# EAGLE design USB_RS232_Adaper_V2 (EAGLE 9.6.2)
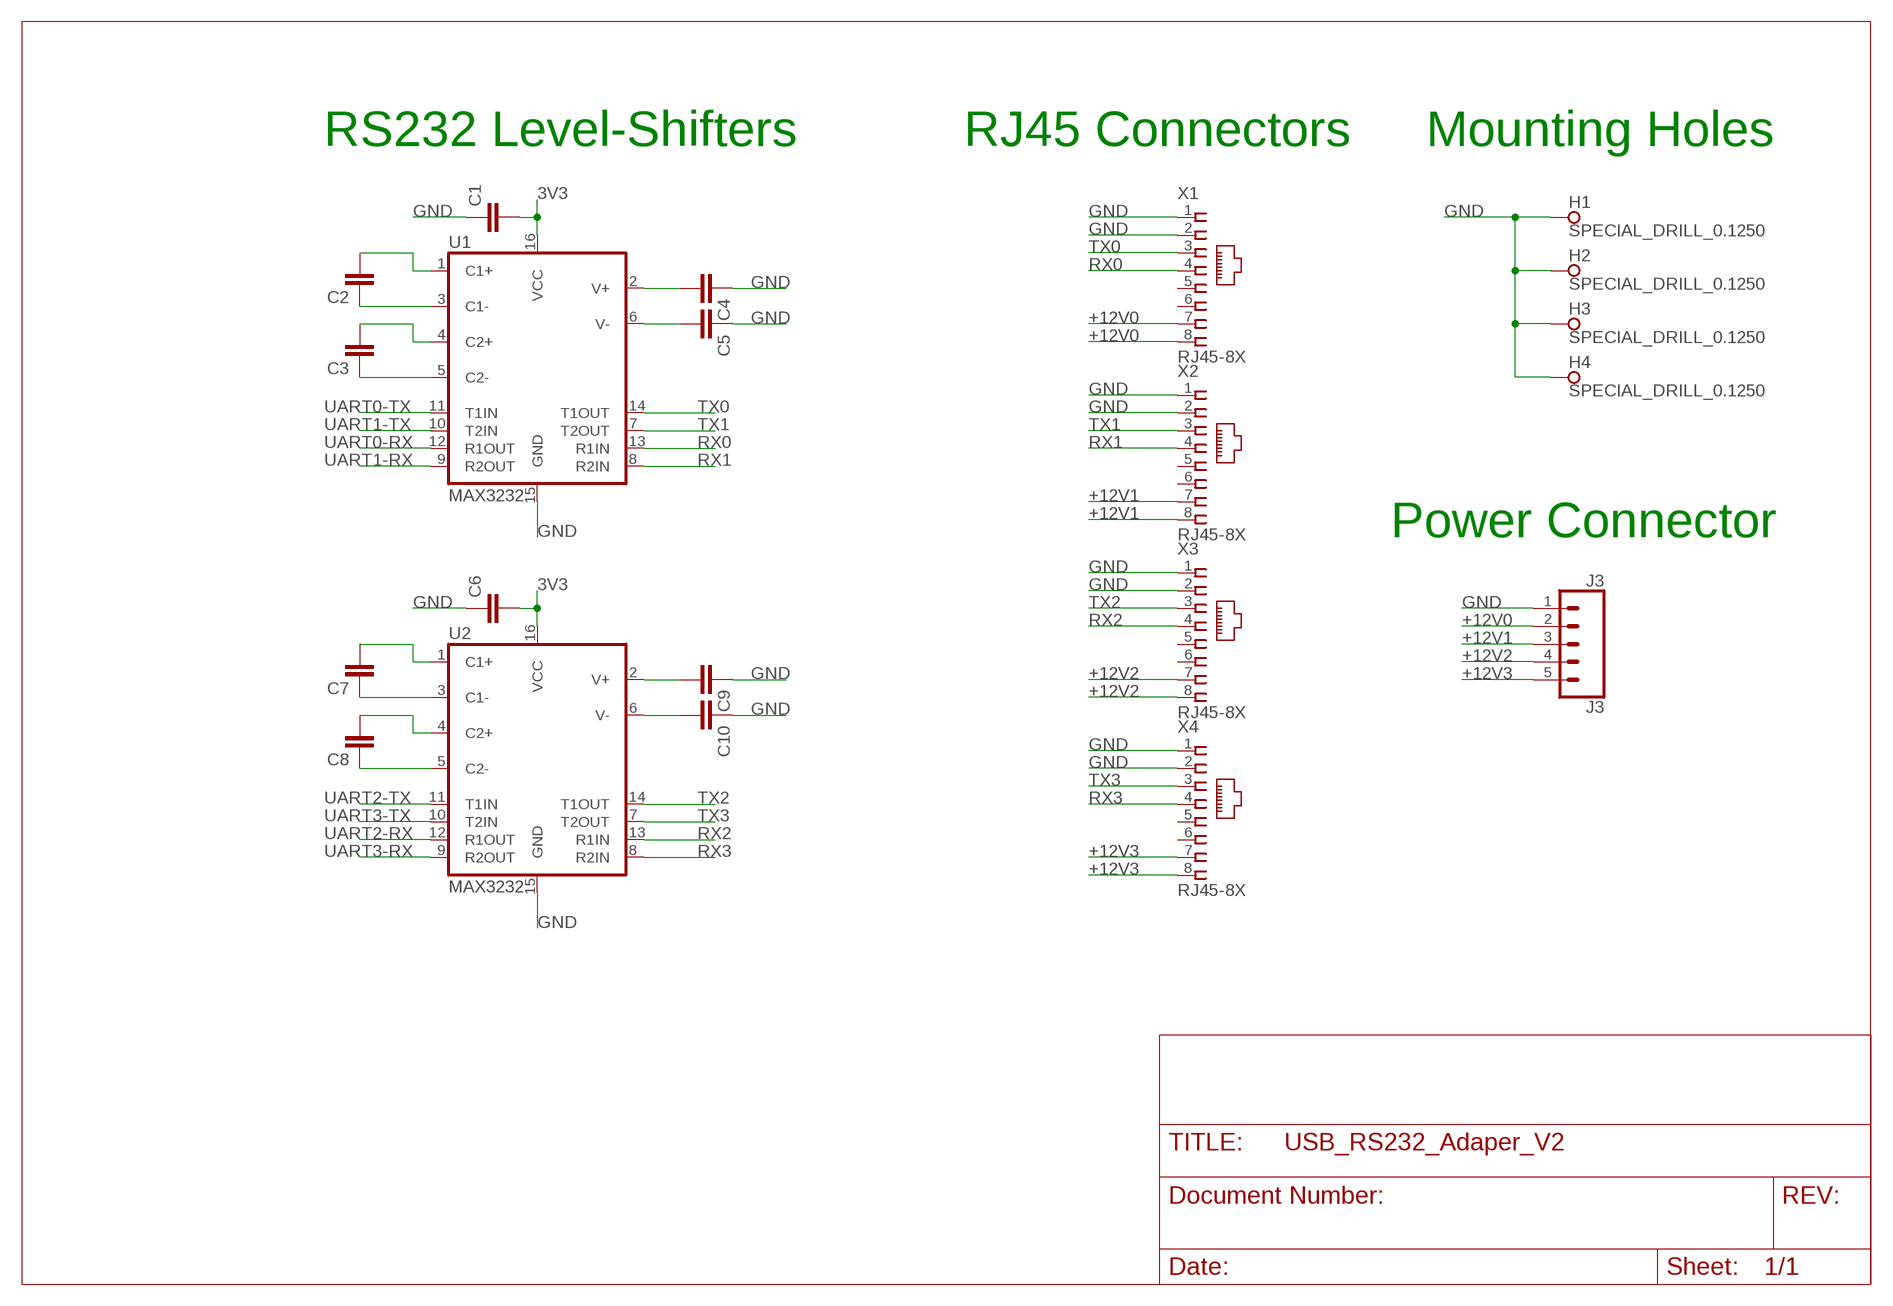
[diagram p0: schematic, sheet 1, part 1 of 2]
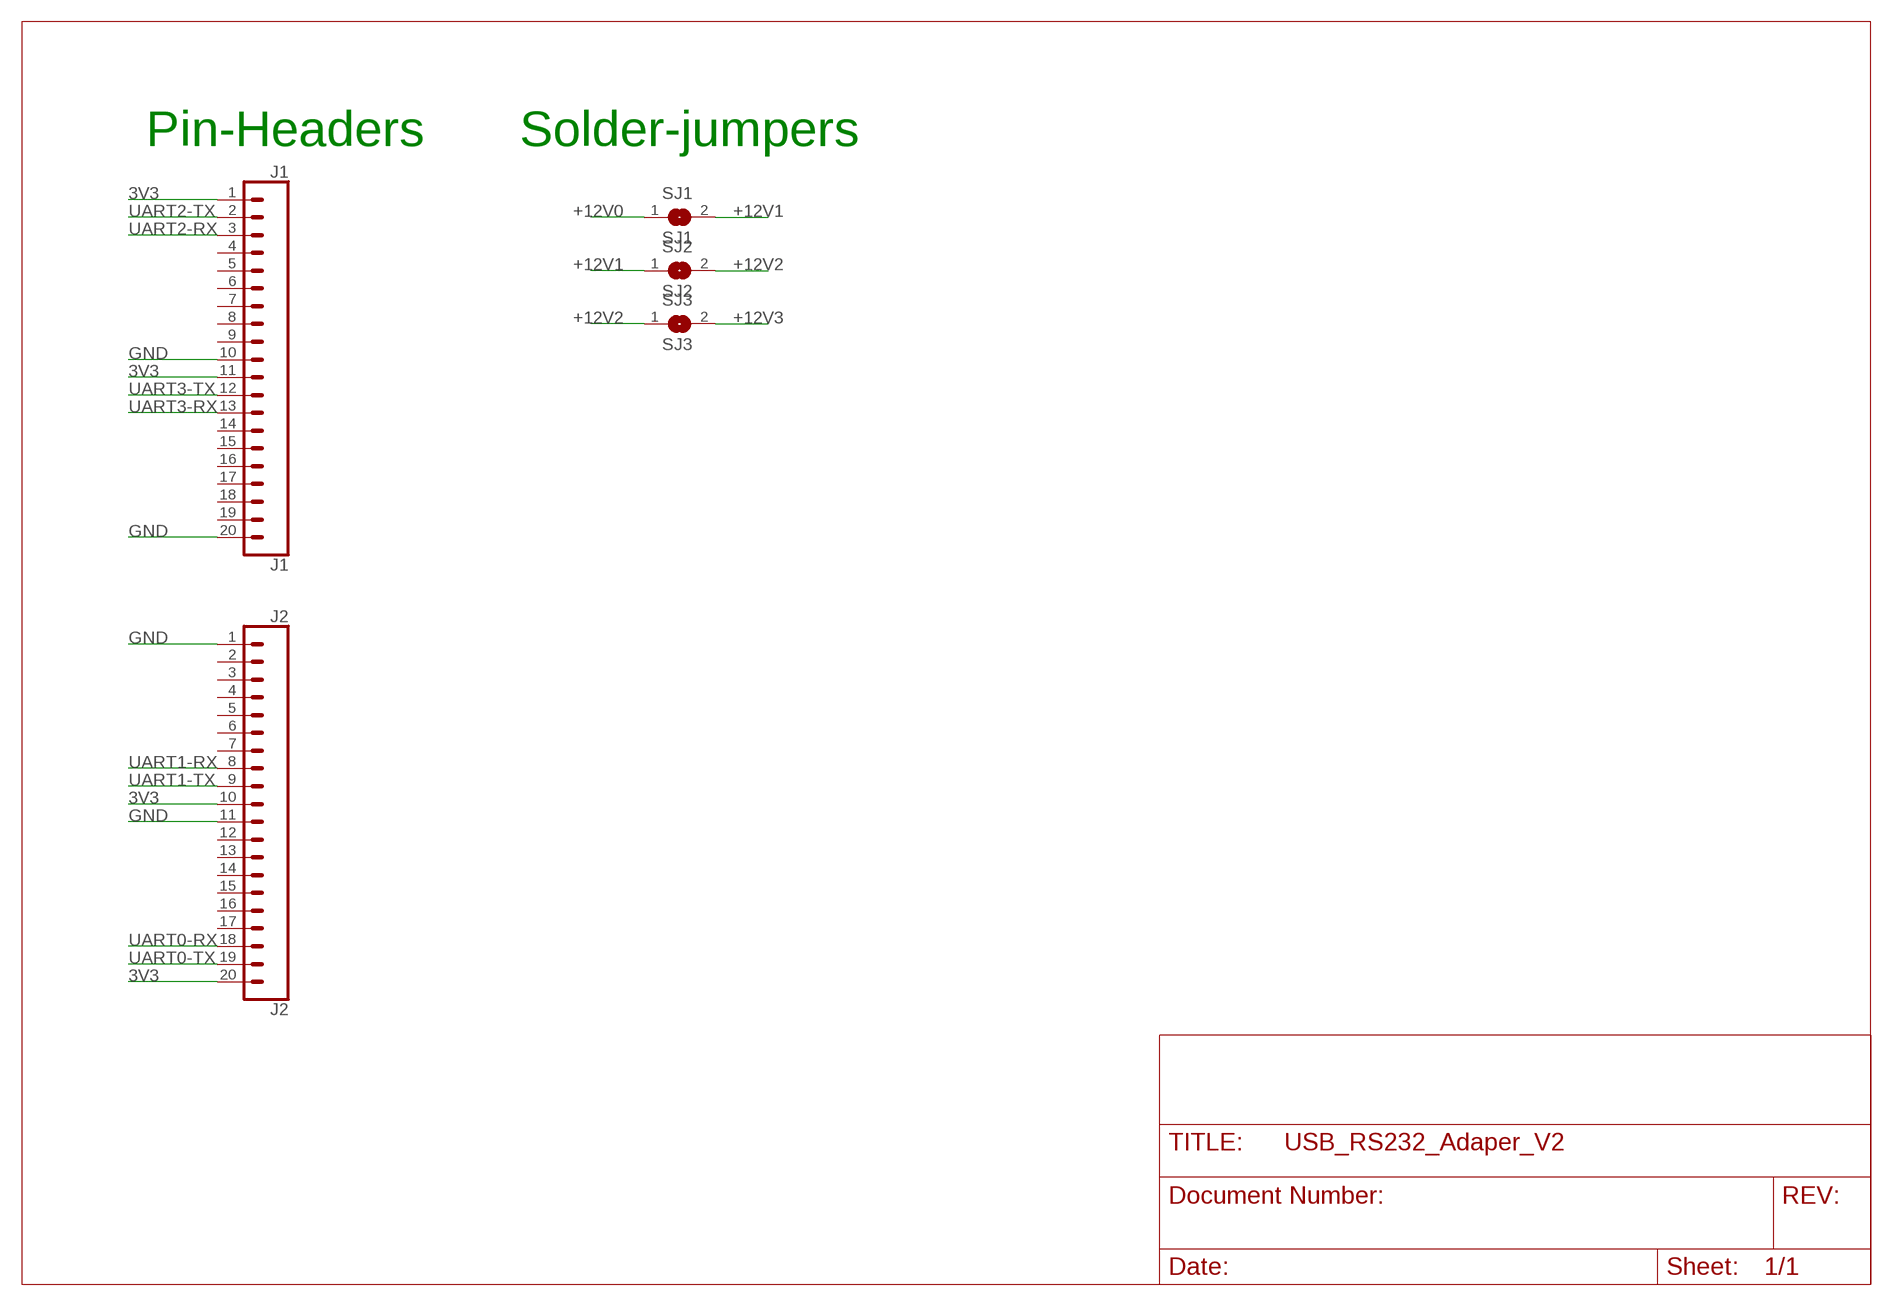
[diagram p1: schematic, sheet 1, part 2 of 2]

## Parts
C1  0.1uF  CAP-0805  [0805]
C2  0.1uF  CAP-0805  [0805]
C3  0.1uF  CAP-0805  [0805]
C4  0.1uF  CAP-0805  [0805]
C5  0.1uF  CAP-0805  [0805]
C6  0.1uF  CAP-0805  [0805]
C7  0.1uF  CAP-0805  [0805]
C8  0.1uF  CAP-0805  [0805]
C9  0.1uF  CAP-0805  [0805]
C10  0.1uF  CAP-0805  [0805]
H1  SPECIAL_DRILL_0.1250  [PAD_0.1250]
H2  SPECIAL_DRILL_0.1250  [PAD_0.1250]
H3  SPECIAL_DRILL_0.1250  [PAD_0.1250]
H4  SPECIAL_DRILL_0.1250  [PAD_0.1250]
J1  J1  CONN_20  [1X20]
J2  J2  CONN_20  [1X20]
J3  J3  CONN_05  [1X05]
SJ1  SJ1  SJ  [SJ]
SJ2  SJ2  SJ  [SJ]
SJ3  SJ3  SJ  [SJ]
U1  MAX3232  MAX2323SOIC16  [SO16]
U2  MAX3232  MAX2323SOIC16  [SO16]
X1  RJ45-8X  [RJ45-NO-SHIELD]
X2  RJ45-8X  [RJ45-NO-SHIELD]
X3  RJ45-8X  [RJ45-NO-SHIELD]
X4  RJ45-8X  [RJ45-NO-SHIELD]

## Nets
3V3: C1.2 C6.2 J1.1 J1.11 J2.10 J2.20 U1.16(VCC) U2.16(VCC)
+12V0: J3.2 SJ1.1 X1.7 X1.8
+12V1: J3.3 SJ1.2 SJ2.1 X2.7 X2.8
+12V2: J3.4 SJ2.2 SJ3.1 X3.7 X3.8
+12V3: J3.5 SJ3.2 X4.7 X4.8
GND: C1.1 C4.1 C5.1 C6.1 C9.1 C10.1 H1.1 H2.1 H3.1 H4.1 J1.10 J1.20 J2.1 J2.11 J3.1 U1.15(GND) U2.15(GND) X1.1 X1.2 X2.1 X2.2 X3.1 X3.2 X4.1 X4.2
N$1: C2.1 U1.3(C1-)
N$2: C2.2 U1.1(C1+)
N$3: C3.1 U1.5(C2-)
N$4: C3.2 U1.4(C2+)
N$5: C4.2 U1.2(V+)
N$6: C5.2 U1.6(V-)
N$7: C9.2 U2.2(V+)
N$8: C10.2 U2.6(V-)
N$9: C7.1 U2.3(C1-)
N$10: C8.1 U2.5(C2-)
N$11: C8.2 U2.4(C2+)
N$12: C7.2 U2.1(C1+)
RX0: U1.13(R1IN) X1.4
RX1: U1.8(R2IN) X2.4
RX2: U2.13(R1IN) X3.4
RX3: U2.8(R2IN) X4.4
TX0: U1.14(T1OUT) X1.3
TX1: U1.7(T2OUT) X2.3
TX2: U2.14(T1OUT) X3.3
TX3: U2.7(T2OUT) X4.3
UART0-RX: J2.18 U1.12(R1OUT)
UART0-TX: J2.19 U1.11(T1IN)
UART1-RX: J2.8 U1.9(R2OUT)
UART1-TX: J2.9 U1.10(T2IN)
UART2-RX: J1.3 U2.12(R1OUT)
UART2-TX: J1.2 U2.11(T1IN)
UART3-RX: J1.13 U2.9(R2OUT)
UART3-TX: J1.12 U2.10(T2IN)
Unconnected: J1.4 J1.5 J1.6 J1.7 J1.8 J1.9 J1.14 J1.15 J1.16 J1.17 J1.18 J1.19 J2.2 J2.3 J2.4 J2.5 J2.6 J2.7 J2.12 J2.13 J2.14 J2.15 J2.16 J2.17 X1.5 X1.6 X2.5 X2.6 X3.5 X3.6 X4.5 X4.6

## Notes on the sheet
- RS232 Level-Shifters | RJ45 Connectors | Mounting Holes | Pin-Headers | Solder-jumpers
- Power Connector

## Library data of the parts
C1-C10 = SparkFun-Capacitors:CAP
H1-H4 = special-drill:SPECIAL_DRILL_: Special drills
J1 J2 = SparkFun-Connectors:CONN_20: Multi connection point. Often used as Generic Header-pin footprint for 0.1 inch spaced/style header connections On any of the 0.1 inch spaced packages, you can populate with these: Break Away Headers - Straight <https://www.sparkfun.com/products/116> (PRT-00116) Break Away Male Headers - Right Angle <https://www.sparkfun.com/products/553> (PRT-00553) Female Headers <https://www.sparkfun.com/products/115> (PRT-00115) Break Away Headers - Machine Pin <https://www.sparkfun.com/products/117> (PRT-00117) Break Away Female Headers - Swiss Machine Pin <https://www.sparkfun.com/products/743> (PRT-00743) For SCREWTERMINALS and SPRING TERMINALS visit here: Screw Terimnals on SparkFun.com <https://www.sparkfun.com/search/results?term=Screw+Terminals> (5mm/3.5mm/2.54mm spacing) This device is also useful as a general connection point to wire up your design to another part of your project. Our various solder wires solder well into these plated through hole pads. Hook-Up Wire - Assortment (Stranded, 22 AWG) <https://www.sparkfun.com/products/11375> (PRT-11375) Hook-Up Wire - Assortment (Solid Core, 22 AWG) <https://www.sparkfun.com/products/11367> (PRT-11367) View the entire wire category on our website here <https://www.sparkfun.com/categories/141> Special notes: Molex polarized connector foot print use with SKU : PRT-08231 with associated crimp pins and housings. 1MM SMD Version SKU: PRT-10208 NOTES ON THE VARIANTS LOCK and LOCK_LONGPADS... This footprint was designed to help hold the alignment of a through-hole component (i.e. 6-pin header) while soldering it into place. You may notice that each hole has been shifted either up or down by 0.005 of an inch from it's more standard position (which is a perfectly straight line). This slight alteration caused the pins (the squares in the middle) to touch the edges of the holes. Because they are alternating, it causes a "brace" to hold the component in place. 0.005 has proven to be the perfect amount of "off-center" position when using our standard breakaway headers. Although looks a little odd when you look at the bare footprint, once you have a header in there, the alteration is very hard to notice. Also,if you push a header all the way into place, it is covered up entirely on the bottom side. Note about LOCK SPECIAL package: This is just like the LOCK variant in that the holes are staggared by 5 mil, but except for the last two holes. They are not altered from the "standard" footprint layout. This is used for a special purpose on the layout of our Graphic LCD Backpack. Make sure you want to use this device before selecting it for you project!
J3 = SparkFun-Connectors:CONN_05: Multi connection point. Often used as Generic Header-pin footprint for 0.1 inch spaced/style header connections On any of the 0.1 inch spaced packages, you can populate with these: Break Away Headers - Straight <https://www.sparkfun.com/products/116> (PRT-00116) Break Away Male Headers - Right Angle <https://www.sparkfun.com/products/553> (PRT-00553) Female Headers <https://www.sparkfun.com/products/115> (PRT-00115) Break Away Headers - Machine Pin <https://www.sparkfun.com/products/117> (PRT-00117) Break Away Female Headers - Swiss Machine Pin <https://www.sparkfun.com/products/743> (PRT-00743) For SCREWTERMINALS and SPRING TERMINALS visit here: Screw Terimnals on SparkFun.com <https://www.sparkfun.com/search/results?term=Screw+Terminals> (5mm/3.5mm/2.54mm spacing) This device is also useful as a general connection point to wire up your design to another part of your project. Our various solder wires solder well into these plated through hole pads. Hook-Up Wire - Assortment (Stranded, 22 AWG) <https://www.sparkfun.com/products/11375> (PRT-11375) Hook-Up Wire - Assortment (Solid Core, 22 AWG) <https://www.sparkfun.com/products/11367> (PRT-11367) View the entire wire category on our website here <https://www.sparkfun.com/categories/141> Special notes: Molex polarized connector foot print use with SKU : PRT-08231 with associated crimp pins and housings. 1MM SMD Version SKU: PRT-10208
SJ1-SJ3 = jumper:SJ: SMD solder JUMPER
U1 U2 = SparkFun-IC-Comms:MAX2323: RS232 Transceiver This part covers 232 drivers that are compatible with the MAX3232. Sipex SP3232EB Datasheet <http://cdn.sparkfun.com/datasheets/Components/General%20IC/SP3232EBCA-L.pdf> SparkFun Products SOIC component <https://www.sparkfun.com/products/589> (COM-00589 / IC-08171) Retired DIP component (COM-00316 / IC-08446) SparkFun Transceiver Breakout - MAX3232 <https://www.sparkfun.com/products/11189> (BOB-11189) SparkFun XBee Explorer Serial <https://www.sparkfun.com/products/13225> (WRL-13225); PROD_ID: IC-08171
X1-X4 = con-tycoelectronics:RJ45: CORCOM Modular RJ Jacks No Shield Source: www.tycoelectronics.com .. ENG_DS_1654001_1099_RJ_L_0507.pdf; MPN: RJ45-8X; OC_FARNELL: unknown; OC_NEWARK: 16R6101

## Board
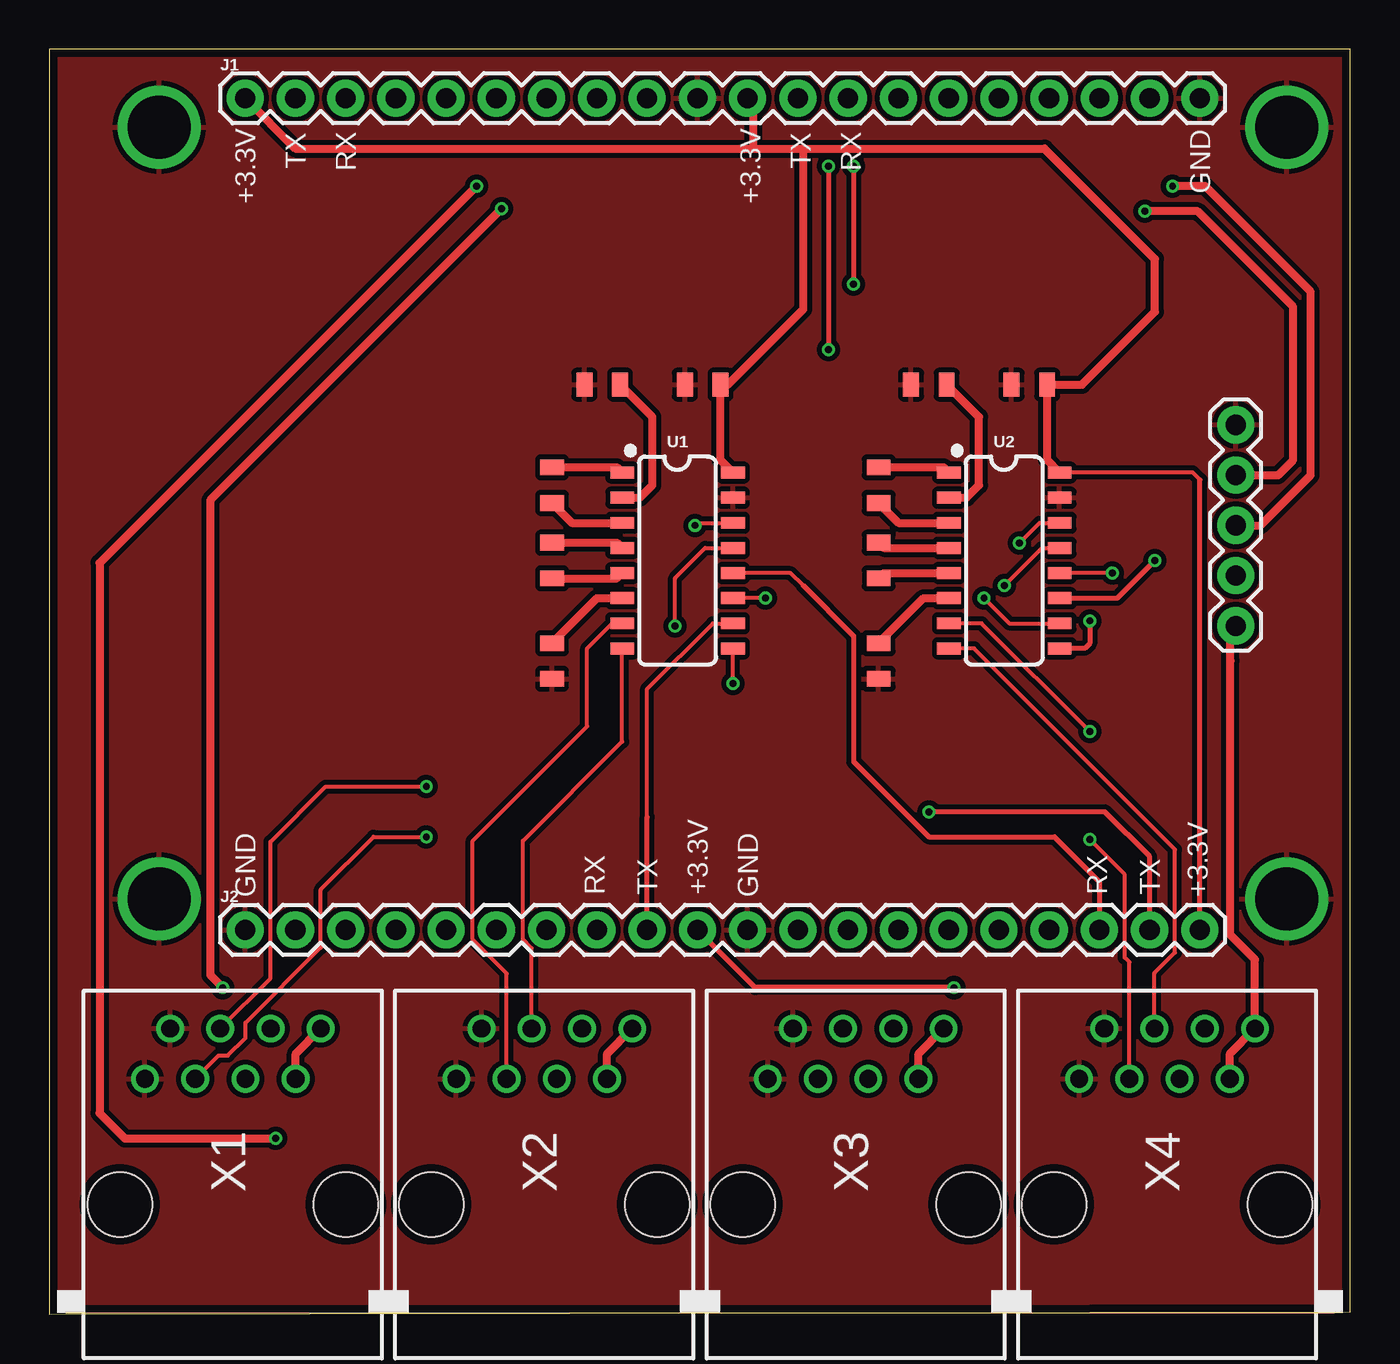
[diagram p2: board, top side]
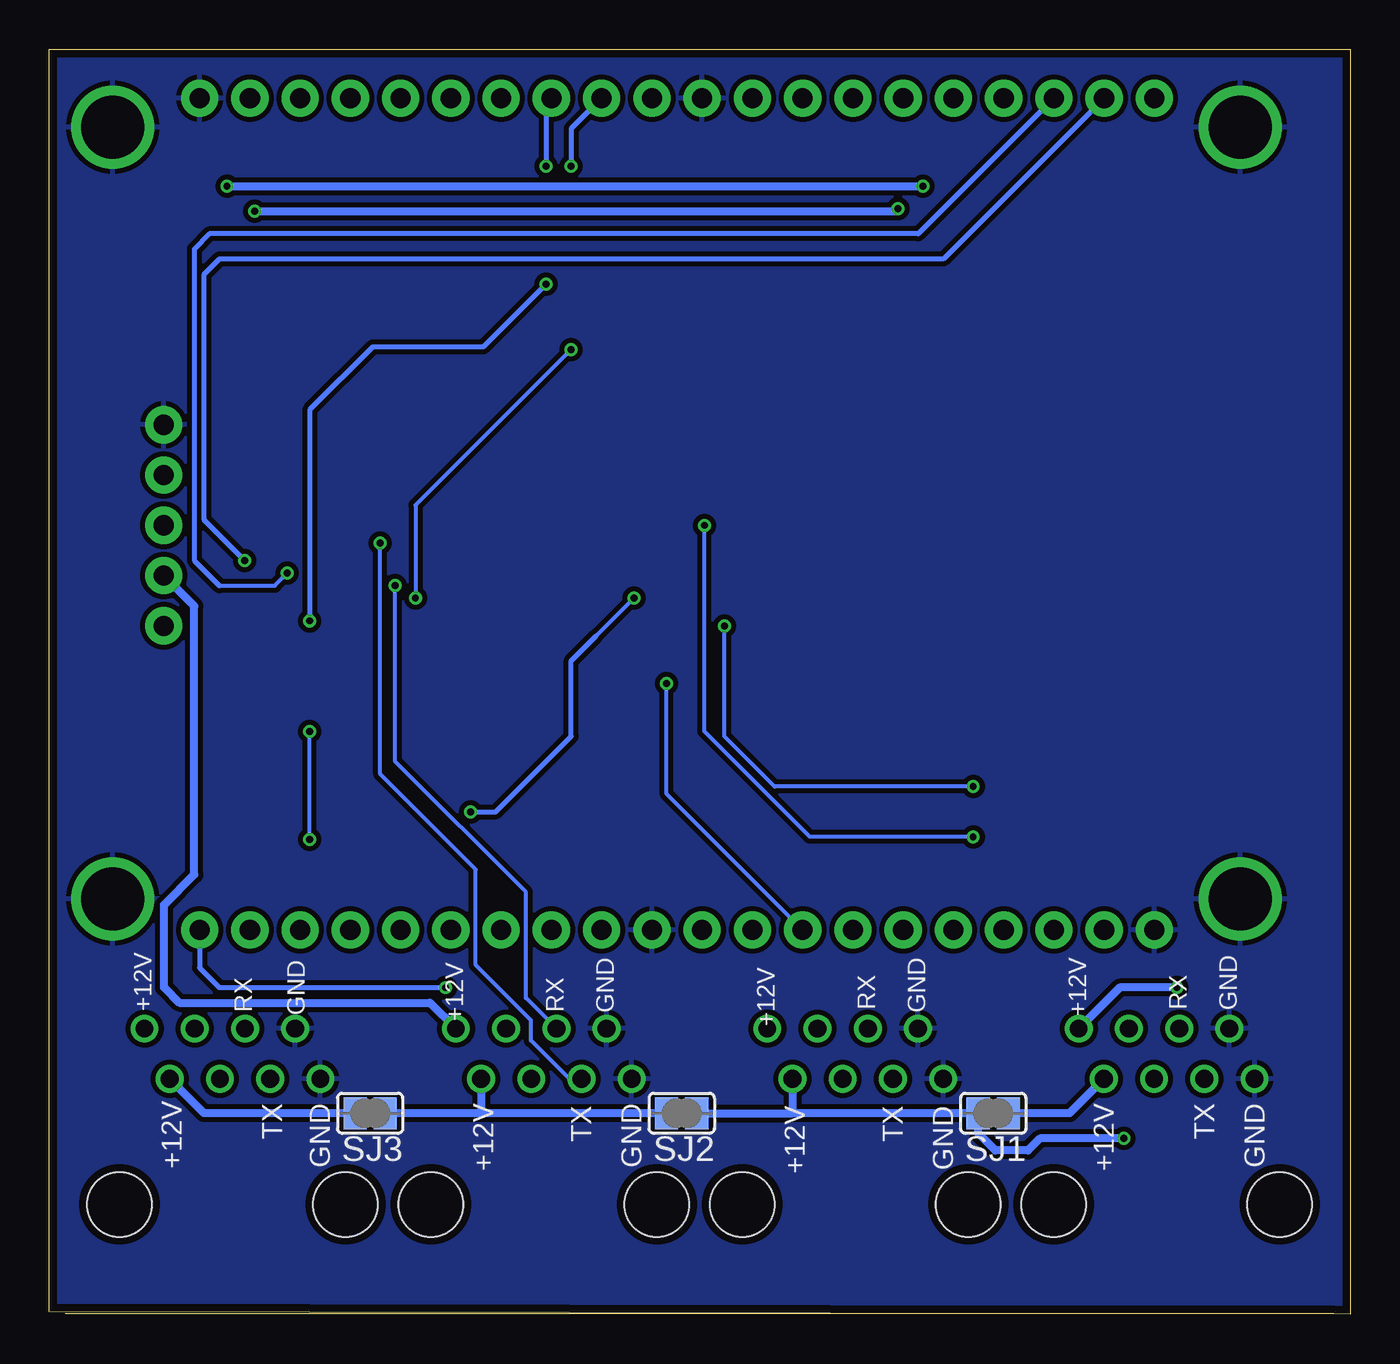
[diagram p3: board, bottom side, seen from below]

Size 65.74 x 63.93 mm. Coordinates in mm from the lower left corner, seen from the top.
Outline: 0,0 65.74,0.13 65.74,63.93 0,63.93 0,0
Copper layers (1*16): Top 0.035mm / dielectric 1.5mm / Bottom 0.035mm
Design rules "NOA Eagle Rule 2016-06-12": minimum track width 6mil, minimum drill 0.3mm, track to track 6mil, track to pad 6mil, pad to pad 6mil, via to via 6mil, smd to smd 0mil, copper to edge 0.4mm, drill to drill 10mil, minimum pad ring 10mil, minimum via ring 6mil, stop-mask expansion 2mil, vias tented up to drill 25mil, thermal gap 10mil

### Footprints (pad centres in the part's own frame; a part is rotated, then mirrored left to right if it is on the bottom)
0805 = smd 0.8 x 1.2: 1 -0.9,0; 2 0.9,0
PAD_0.1250 = drill 3.175 pad 3.175: 1 0,0
1X20 = drill 1.016 pad 1.88: 1 0,0; 2 2.54,0; 3 5.08,0; 4 7.62,0; 5 10.16,0; 6 12.7,0; 7 15.24,0; 8 17.78,0; 9 20.32,0; 10 22.86,0; 11 25.4,0; 12 27.94,0; 13 30.48,0; 14 33.02,0; 15 35.56,0; 16 38.1,0; 17 40.64,0; 18 43.18,0; 19 45.72,0; 20 48.26,0
1X05 = drill 1.016 pad 1.88: 1 0,0; 2 2.54,0; 3 5.08,0; 4 7.62,0; 5 10.16,0
SJ = smd 1.168 x 1.6: 1 -0.762,0; 2 0.762,0
SO16 = smd 0.6 x 1.2: 1 -4.445,-2.8; 2 -3.175,-2.8; 3 -1.905,-2.8; 4 -0.635,-2.8; 5 0.635,-2.8; 6 1.905,-2.8; 7 3.175,-2.8; 8 4.445,-2.8; 9 4.445,2.8; 10 3.175,2.8; 11 1.905,2.8; 12 0.635,2.8; 13 -0.635,2.8; 14 -1.905,2.8; 15 -3.175,2.8; 16 -4.445,2.8
RJ45-NO-SHIELD = drill 0.9 pad 1.4: 1 -4.445,6.35; 2 -3.175,8.89; 3 -1.905,6.35; 4 -0.635,8.89; 5 0.635,6.35; 6 1.905,8.89; 7 3.175,6.35; 8 4.445,8.89 | hole 3.251: -5.715,0; 5.715,0

### Placement (x,y rotation side)
C1  33.02,46.99 0 top
C2  25.4,41.91 90 top
C3  25.4,38.1 90 top
C4  27.94,46.99 0 top
C5  25.4,33.02 90 top
C6  49.53,46.99 0 top
C7  41.91,41.91 90 top
C8  41.91,38.1 90 top
C9  44.45,46.99 0 top
C10  41.91,33.02 90 top
H1  5.54,60 0 top
H2  5.54,21 0 top
H3  62.54,60 0 top
H4  62.54,21 0 top
J1  9.89,61.47 0 top
J2  9.89,19.43 0 top
J3  59.96,44.96 270 top
SJ1  18.03,10.16 180 bottom
SJ2  33.78,10.16 180 bottom
SJ3  49.53,10.16 180 bottom
U1  31.75,38.1 270 top
U2  48.26,38.1 270 top
X1  9.27,5.55 0 top
X2  25.01,5.55 0 top
X3  40.75,5.55 0 top
X4  56.49,5.55 0 top

### Tracks (layer width: path | path; a pad name or v marks a point on that pad's centre or on a via)
3V3  (via drill 0.35)
  Top 0.203: 58.15,42.18 57.78,42.55 U2.16
  Top 0.254: J2.20 58.15,42.18 | v45.72,16.51 35.67,16.51 J2.10
  Top 0.406: J1.1 12.43,58.93 35.56,58.93 | 35.56,58.93 38.1,58.93 | 38.1,58.93 50.29,58.93 55.88,53.34 55.88,50.67 52.2,46.99 C6.2 50.43,43.17 U2.16 | J1.11 35.56,61.2 35.56,58.93 | 38.1,58.93 38.1,50.8 34.29,46.99 C1.2 33.92,43.17 U1.16
  Bottom 0.254: J2.20 58.15,17.51 57.15,16.51 v45.72,16.51
+12V0  (via drill 0.35)
  Top 0.406: X1.7 12.45,13.17 X1.8 | J3.2 62.1,42.42 62.87,43.18 62.87,50.93 58.17,55.63 58.04,55.75 v55.37,55.75 | v22.86,55.88 8.13,41.15 8.13,17.14 v8.76,16.51
  Bottom 0.406: X1.7 14.19,10.16 SJ1.1 | v55.37,55.75 22.99,55.75 v22.86,55.88 | v8.76,16.51 11.65,16.51 X1.8
+12V1  (via drill 0.35)
  Top 0.406: X2.7 28.19,13.17 X2.8 | J3.3 61.21,39.88 63.75,42.42 63.75,51.69 58.42,57.02 v56.77,57.02 | v21.59,57.02 2.54,37.97 2.54,10.16 3.81,8.89 v11.43,8.89
  Bottom 0.406: 28.19,10.16 SJ1.2 18.8,9.14 17.93,8.28 16.28,8.28 15.67,8.89 v11.43,8.89 | SJ2.1 28.19,10.16 | v56.77,57.02 v21.59,57.02 | X2.7 28.19,10.16
+12V2
  Top 0.406: X3.7 43.93,13.17 X3.8
  Bottom 0.406: SJ2.2 43.94,10.16 | 43.94,10.16 SJ3.1 | X3.8 46.5,15.75 59.18,15.75 59.94,16.51 59.94,20.7 58.42,22.23 58.42,35.8 J3.4 | X3.7 43.93,10.18 43.94,10.16
+12V3
  Top 0.406: X4.7 59.67,13.17 X4.8 60.94,17.93 59.69,19.18 59.69,33.02 59.69,33.53 59.69,34.53 J3.5
  Bottom 0.406: SJ3.2 57.93,10.16 X4.7
GND
  pour Top (isolate 0.254): -1.27,66.55 -1.27,-2.54 67.31,-2.54 67.31,66.55
  pour Bottom (isolate 0.254): -1.27,66.55 -1.27,-2.54 67.31,-2.54 67.31,66.55
N$1
  Top 0.406: C2.1 26.4,40.01 U1.3
N$2
  Top 0.406: C2.2 28.68,42.81 U1.1
N$3
  Top 0.406: C3.1 28.68,37.2 U1.5
N$4
  Top 0.406: C3.2 28.68,39 U1.4
N$5
  Top 0.406: U1.2 29.84,41.27 30.48,41.91 30.48,45.35 C4.2
N$6
  Top 0.406: C5.2 27.68,36.2 U1.6
N$7
  Top 0.406: U2.2 46.35,41.27 46.99,41.91 46.99,45.35 C9.2
N$8
  Top 0.406: C10.2 44.19,36.2 U2.6
N$9
  Top 0.406: C7.1 42.91,40.01 U2.3
N$10
  Top 0.406: C8.1 42.17,37.47 U2.5
N$11
  Top 0.406: C8.2 42.17,38.73 U2.4
N$12
  Top 0.406: C7.2 45.2,42.81 U2.1
RX0  (via drill 0.35)
  Top 0.203: X1.4 11.18,16.98 11.18,23.88 13.97,26.67 v19.05,26.67 | v31.62,34.8 31.62,37.21 33.15,38.73 U1.13
  Bottom 0.203: v19.05,26.67 29.08,26.67 31.62,29.21 v31.62,34.8
RX1
  Top 0.203: X2.4 24.38,18.5 23.94,18.94 23.94,23.94 28.95,28.95 U1.8
RX2  (via drill 0.35)
  Top 0.203: v48.26,36.83 50.16,38.73 U2.13
  Bottom 0.203: X3.4 41.66,15.98 41.66,21.34 48.26,27.94 v48.26,36.83
RX3
  Top 0.203: X4.4 55.86,17.25 56.9,18.29 56.9,23.5 46.74,33.66 U2.8
TX0  (via drill 0.35)
  Top 0.203: X1.3 8.55,13.08 9.02,13.08 9.91,13.97 9.91,14.73 13.72,18.54 13.72,21.46 16.38,24.13 v19.05,24.13 | v32.64,39.88 32.77,40.01 U1.14
  Bottom 0.203: v19.05,24.13 27.3,24.13 32.64,29.46 v32.64,39.88
TX1
  Top 0.203: X2.3 23.11,17.23 21.4,18.94 21.4,23.94 27.18,29.72 27.18,33.66 28.45,34.92 U1.7
TX2  (via drill 0.35)
  Top 0.203: v49.02,38.99 50.04,40.01 U2.14
  Bottom 0.203: X3.3 39.46,11.9 41.4,13.84 41.4,14.86 44.2,17.65 44.2,22.48 49.02,27.3 v49.02,38.99
TX3  (via drill 0.35)
  Top 0.203: X4.3 54.59,17.8 54.36,18.03 54.36,22.23 v52.58,24 | v52.58,29.46 47.12,34.92 U2.7
  Bottom 0.203: v52.58,24 v52.58,29.46
UART0-RX
  Top 0.203: 38.1,36.83 37.46,37.47 U1.12
  Top 0.254: 38.1,36.83 40.64,34.29 40.64,27.94 44.45,24.13 50.8,24.13 53.07,21.86 J2.18
UART0-TX  (via drill 0.35)
  Top 0.203: v36.2,36.2 U1.11
  Top 0.254: J2.19 55.61,23.13 53.34,25.4 v44.45,25.4
  Bottom 0.203: 38.1,34.29 v36.2,36.2
  Bottom 0.254: v44.45,25.4 43.18,25.4 39.37,29.21 39.37,33.02 38.1,34.29
UART1-RX  (via drill 0.35)
  Top 0.203: v34.54,31.88 U1.9
  Bottom 0.203: J2.8 34.54,26.3 v34.54,31.88
UART1-TX
  Top 0.203: 30.21,25.13 30.21,31.61 33.53,34.92 U1.10
  Top 0.254: J2.9 30.21,25.13
UART2-RX  (via drill 0.35)
  Top 0.203: v53.72,37.47 U2.12
  Bottom 0.203: 57.15,36.83 54.36,36.83 v53.72,37.47
  Bottom 0.254: J1.3 21.83,54.61 57.66,54.61 58.42,53.85 58.42,38.1 57.15,36.83
UART2-TX  (via drill 0.35)
  Top 0.254: U2.11 53.98,36.2 v55.88,38.1
  Bottom 0.254: J1.2 20.56,53.34 57.15,53.34 57.91,52.58 57.91,40.13 v55.88,38.1
UART3-RX  (via drill 0.35)
  Top 0.254: v40.64,58.04 v40.64,52.07 | v52.58,35.05 52.58,33.91 52.32,33.66 U2.9
  Bottom 0.254: J1.13 40.64,61.2 v40.64,58.04 | v40.64,52.07 43.81,48.9 49.4,48.9 52.58,45.72 v52.58,35.05
UART3-TX  (via drill 0.35)
  Top 0.203: v47.24,36.2 48.51,34.92 U2.10
  Top 0.254: v39.37,58.04 v39.37,48.77
  Bottom 0.203: v39.37,48.77 47.24,40.89 v47.24,36.2
  Bottom 0.254: J1.12 39.37,59.93 v39.37,58.04

### Text on the board
tNames: TX | RX | TX | RX | GND | +3.3V | +3.3V | GND | RX | TX | +3.3V | GND | RX | TX | +3.3V
bNames: GND | +12V | GND | +12V | GND | +12V | GND | +12V | RX | RX | RX | RX | GND | TX | +12V | GND | TX | +12V | GND | TX | +12V | GND | TX | +12V